# Altium schematic sheet 06_Ethernet.SchDoc
size A3
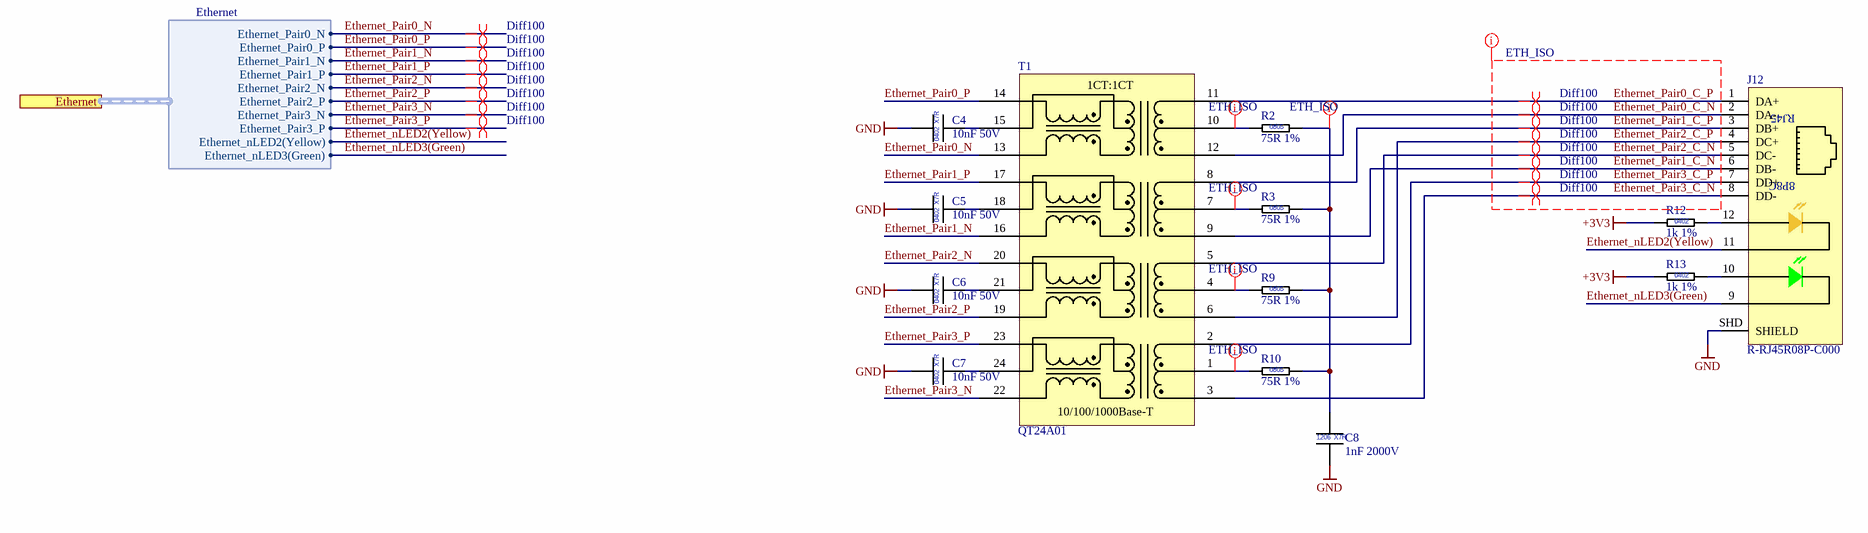
[diagram p0: 06_Ethernet.SchDoc]

## Parts
C4  10nF 50V  [CAP_0402]
C5  10nF 50V  [CAP_0402]
C6  10nF 50V  [CAP_0402]
C7  10nF 50V  [CAP_0402]
C8  1nF 2000V  [CAP_1206]
J12  R-RJ45R08P-C000  [Ckmtw - R-RJ45R08P-C000]
R2  75R 1%  [RES_0805]
R3  75R 1%  [RES_0805]
R9  75R 1%  [RES_0805]
R10  75R 1%  [RES_0805]
R12  1k 1%  [RES_0402]
R13  1k 1%  [RES_0402]
T1  QT24A01  [QT24A01]

## Ports
Ethernet (harness Ethernet)

## Harnesses
Ethernet: Ethernet_Pair0_N, Ethernet_Pair0_P, Ethernet_Pair1_N, Ethernet_Pair1_P, Ethernet_Pair2_N, Ethernet_Pair2_P, Ethernet_Pair3_N, Ethernet_Pair3_P, Ethernet_nLED2(Yellow), Ethernet_nLED3(Green)

## Nets
+3V3: R12.1 R13.1
GND: C4.1 C5.1 C6.1 C7.1 C8.2 J12.SHD(SHIELD)
Ethernet_nLED2(Yellow): J12.11 ; port Ethernet.Ethernet_nLED2(Yellow)
Ethernet_nLED3(Green): J12.9 ; port Ethernet.Ethernet_nLED3(Green)
Ethernet_Pair0_C_N: J12.2(DA-) T1.12(TD4-)
Ethernet_Pair0_C_P: J12.1(DA+) T1.11(TD4+)
Ethernet_Pair0_N: T1.13(MX4-) ; port Ethernet.Ethernet_Pair0_N
Ethernet_Pair0_P: T1.14(MX4+) ; port Ethernet.Ethernet_Pair0_P
Ethernet_Pair1_C_N: J12.6(DB-) T1.9(TD3-)
Ethernet_Pair1_C_P: J12.3(DB+) T1.8(TD3+)
Ethernet_Pair1_N: T1.16(MX3-) ; port Ethernet.Ethernet_Pair1_N
Ethernet_Pair1_P: T1.17(MX3+) ; port Ethernet.Ethernet_Pair1_P
Ethernet_Pair2_C_N: J12.5(DC-) T1.5(TD2+)
Ethernet_Pair2_C_P: J12.4(DC+) T1.6(TD2-)
Ethernet_Pair2_N: T1.20(MX2+) ; port Ethernet.Ethernet_Pair2_N
Ethernet_Pair2_P: T1.19(MX2-) ; port Ethernet.Ethernet_Pair2_P
Ethernet_Pair3_C_N: J12.8(DD-) T1.3(TD1-)
Ethernet_Pair3_C_P: J12.7(DD+) T1.2(TD1+)
Ethernet_Pair3_N: T1.22(MX1-) ; port Ethernet.Ethernet_Pair3_N
Ethernet_Pair3_P: T1.23(MX1+) ; port Ethernet.Ethernet_Pair3_P
NetC4_2: C4.2 T1.15(MCT4)
NetC5_2: C5.2 T1.18(MCT3)
NetC6_2: C6.2 T1.21(MCT2)
NetC7_2: C7.2 T1.24(MCT1)
NetC8_1: C8.1 R2.2 R3.2 R9.2 R10.2
NetJ12_10: J12.10 R13.2
NetJ12_12: J12.12 R12.2
NetR2_1: R2.1 T1.10(TCT4)
NetR3_1: R3.1 T1.7(TCT3)
NetR9_1: R9.1 T1.4(TCT2)
NetR10_1: R10.1 T1.1(TCT1)

## Layout directives
differential pair; net class Diff100: Ethernet_Pair0_C_N, Ethernet_Pair0_C_P, Ethernet_Pair0_N, Ethernet_Pair0_P, Ethernet_Pair1_C_N, Ethernet_Pair1_C_P, Ethernet_Pair1_N, Ethernet_Pair1_P, Ethernet_Pair2_C_N, Ethernet_Pair2_C_P, Ethernet_Pair2_N, Ethernet_Pair2_P, Ethernet_Pair3_C_N, Ethernet_Pair3_C_P, Ethernet_Pair3_N, Ethernet_Pair3_P
net class ETH_ISO: Ethernet_Pair0_C_N, Ethernet_Pair0_C_P, Ethernet_Pair1_C_N, Ethernet_Pair1_C_P, Ethernet_Pair2_C_N, Ethernet_Pair2_C_P, Ethernet_Pair3_C_N, Ethernet_Pair3_C_P, NetC8_1, NetR2_1, NetR3_1, NetR9_1, NetR10_1

## Notes on the sheet
- Title:
- ++CONFIDENTIAL++
- Date:
- Sheet:
- /
- Time:
- Engineer
- Elektronik- und Softwareentwicklung aus Nürnberg
- The  information  contained  in  these  documents  is  confidential,  privileged  and  only  for  the
  information of the intended recipient and may
  not be used, published or redistributed without
  the prior written consent from PCB Arts GmbH.
- Revision:
- Checked:
- https://pcb-arts.com/
- mail@pcb-arts.com
- (in symbol CAP_0402_10nF_50V) X7R; 0402
- (in symbol CAP_1206_1nF_2000V) 1206; X7R
- (in symbol QT24A01_10/100/1000Base-T  Single  Port  Transformer) 1CT:1CT; 10/100/1000Base-T
- (in symbol R-RJ45R08P-C000_RJ45 8P8C Shielded Yellow - Green Through Hole Ethernet Connectors) RJ45; 8P8C
- (in symbol RES_0402_1k_1%) 0402
- (in symbol RES_0805_75R_1%) 0805

## Library data of the parts
C4-C7 = CAP_0402_10nF_50V: Multilayer Ceramic Capacitors MLCC - SMD/SMT 0402 50VDC; Manufacturer 1: Wurth Elektronik; Manufacturer 1 Prt. Nr.: 885012205067; Manufacturer 2 Prt. Nr.: AC0402KPX7R9BB103; Manufacturer 2: Yageo
C8 = CAP_1206_1nF_2000V: Multilayer Ceramic Capacitors MLCC - SMD/SMT 1206 2000VDC; Manufacturer 1: Yageo; Manufacturer 1 Prt. Nr.: CC1206MKX7RDBB102; Manufacturer 2 Prt. Nr.: 1206B102M202CT; Manufacturer 2: Walsin
J12 = R-RJ45R08P-C000_RJ45 8P8C Shielded Yellow - Green Through Hole Ethernet Connectors: RJ45 8 1 Shielded Yellow - Green Through Hole Ethernet Connectors/Modular Connectors (RJ45 RJ11) RoHS; Manufacturer 1: Ckmtw(Shenzhen Cankemeng); Manufacturer 1 Prt. Nr.: R-RJ45R08P-C000
R2 R3 R9 R10 = RES_0805_75R_1%: Thick Film Resistors - SMD 75Ohm 1%; Manufacturer 1: Bourns; Manufacturer 1 Prt. Nr.: CR0805-FX-75R0ELF; Manufacturer 2 Prt. Nr.: ERJ-6ENF75R0V; Manufacturer 2: Panasonic
R12 R13 = RES_0402_1k_1%: Thick Film Resistors - SMD 1kOhm 1%; Manufacturer 1: Vishay / Dale; Manufacturer 1 Prt. Nr.: CRCW04021K00FKEDC; Manufacturer 2 Prt. Nr.: RC0402FR-7W1KL; Manufacturer 2: Yageo
T1 = QT24A01_10/100/1000Base-T  Single  Port  Transformer: 1:1 350 28 1.2 -1 -16 SMD,24PIN RJ45 Transformer RoHS; Manufacturer 1: TNK; Manufacturer 1 Prt. Nr.: QT24A01